# EAGLE design Puzzle Hall Sensor v0.9b (EAGLE 6.2)
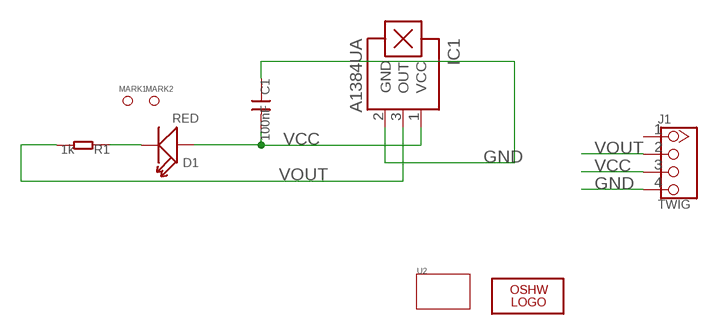
[diagram p0: schematic, sheet 1]

## Parts
C1  100nF  C-0603  [0603]
D1  RED  LED-0603  [D0603]
IC1  A1384UA  [SIP3-UA]
J1  TWIG  TWIG-2.0-LEADED-2.0  [4P-LEADED-2.0]
LOGO1  LOGO-OSHW-FILLX0150-NT  [OSHW_FILLX150_NOTEXT]
MARK1  PAD-MARK  [ROUND-MARK-0.635]
MARK2  PAD-MARK  [ROUND-MARK-0.635]
R1  1k  R-0603  [0603]
U2  TWIG-1U  [1U-DIM-W/-DRILL]

## Nets
GND: C1.1 IC1.2(GND) J1.4
N$1: D1.- R1.1
VCC: C1.2 D1.+ IC1.1(VCC) J1.3
VOUT: IC1.3(OUT) J1.2 R1.2
Unconnected: J1.1

## Library data of the parts
C1 = Discrete:C*: Ceramic Capacitors
D1 = Discrete:LED*
IC1 = allegro:A13*?: Linear Hall Effect Sensor ICs Continuous-Time Ratiometric High-Temperature Operation Programmable Linear with Analog Output A1302 -Replacement- UGN3503 Source: http://www.allegromicro.com/en/Products/Part_Numbers/1301/1301.pdf http://www.allegromicro.com/en/Products/Part_Numbers/1321/1321.pdf http://www.allegromicro.com/en/Products/Part_Numbers/1381/1381.pdf; MPN: A1384LUA-T; OC_FARNELL: unknown; OC_NEWARK: 30M9961
J1 = Connector:TWIG-2.0-LEADED
LOGO1 = Logo:LOGO-OSHW-FILL
MARK1 MARK2 = Discrete:PAD-MARK
R1 = Discrete:R*
U2 = Module:TWIG

## Board
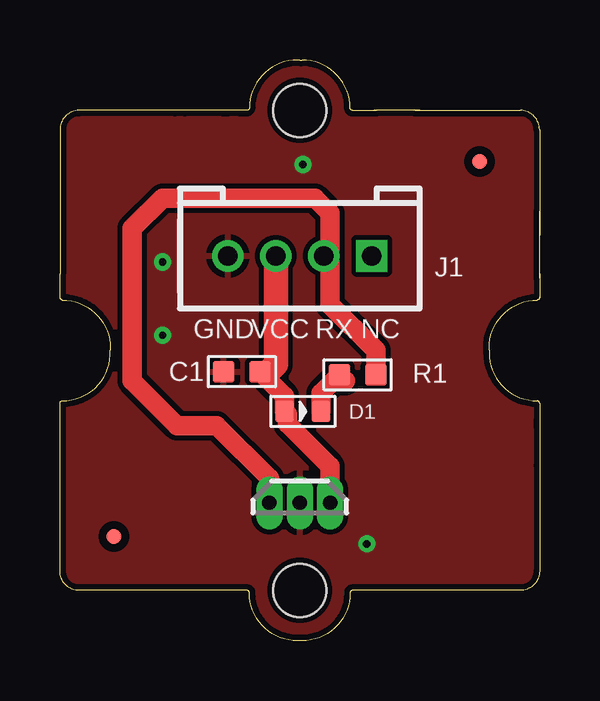
[diagram p1: board, top side]
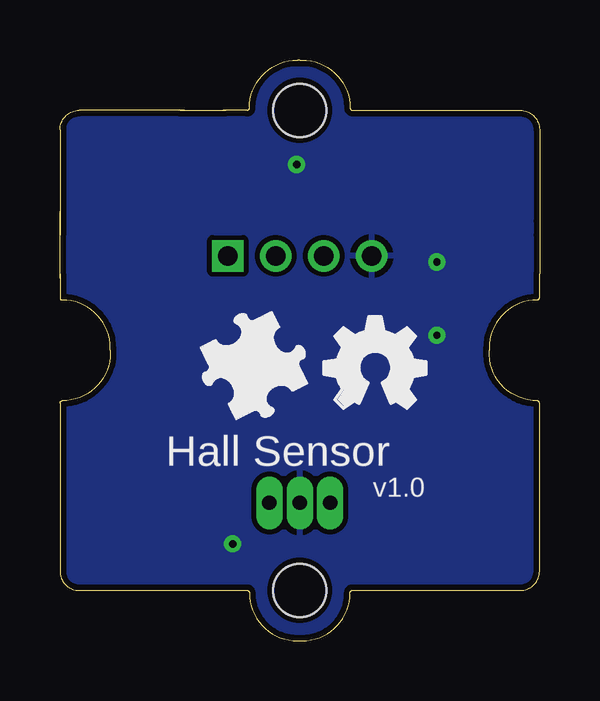
[diagram p2: board, bottom side, seen from below]

Size 20 x 24.2 mm. Coordinates in mm from the lower left corner, seen from the top.
Copper layers (1*16): Top 0.035mm / dielectric 1.5mm / Bottom 0.035mm
Design rules: minimum track width 10mil, minimum drill 10mil, track to track 8mil, track to pad 8mil, pad to pad 8mil, via to via 8mil, smd to smd 8mil, copper to edge 10mil, drill to drill 10mil, minimum pad ring 10mil, minimum via ring 8mil, stop-mask expansion 4mil, vias tented up to drill 0mil, thermal gap 10mil

### Footprints (pad centres in the part's own frame; a part is rotated, then mirrored left to right if it is on the bottom)
0603 = smd 0.889 x 0.889: 1 -0.762,0; 2 0.762,0
D0603 = smd 0.762 x 0.889: + -0.762,0; - 0.762,0
SIP3-UA = drill 0.6 pad 0.7 long: 1 -1.27,0; 2 0,0; 3 1.27,0
4P-LEADED-2.0 = drill 0.8 pad 1.27 square: 1 -3,0 | drill 0.8 pad 1.27: 2 -1,0; 3 1,0; 4 3,0
ROUND-MARK-0.635 = smd 0.635 x 0.635: P$1 0,0
1U-DIM-W/-DRILL = hole 2.2: 0,-10; 0,10

### Placement (x,y rotation side)
C1  7.59,11.21 0 top
D1  10.13,9.56 0 top
IC1  10,5.75 180 top
J1  10,16.04 180 top
LOGO1  8.98,9.69 0 bottom
MARK1  2.25,4.35 0 top
MARK2  17.49,19.97 0 top
R1  12.41,11.08 0 top
U2  10,12.1 180 top
U$1  [BRICK-LOGO-MIL-0.5]  14.44,8.93 0 bottom

### Tracks (layer width: path | path; a pad name or v marks a point on that pad's centre or on a via)
GND  (via drill 0.3 pad 0.61)
  other vias: 4.28,12.74 4.28,15.78 12.79,4.04 10.13,19.85
  pour Bottom: -0.41,-0.6 20.92,-0.6 20.92,24.93 -0.41,24.93
  pour Top: -0.03,-0.22 20.54,-0.22 20.54,24.55 -0.03,24.55
N$1
  Top 0.813: 11.91,10.83 R1.1 10.89,10.32 D1.-
VCC
  Top 0.813: 8.69,11.21 C1.2 9.36,10.2 D1.+ 9.49,9.43 9.49,9.05 11.27,7.27 IC1.1
  Top 1.016: J1.3 9,11.52 8.69,11.21
VOUT
  Top 0.813: R1.2 13.17,12.1 11.27,14.01 11.27,15.77 J1.2 11.27,16.31 11.27,17.81 10.64,18.45 4.28,18.45 3.02,17.18 3.02,10.83 4.89,8.96 6.54,8.96 8.73,6.77 IC1.3

### Text on the board
tPlace: GND | VCC | RX | NC
bPlace: Hall Sensor | v1.0